# Altium project waterpump.PrjPCB
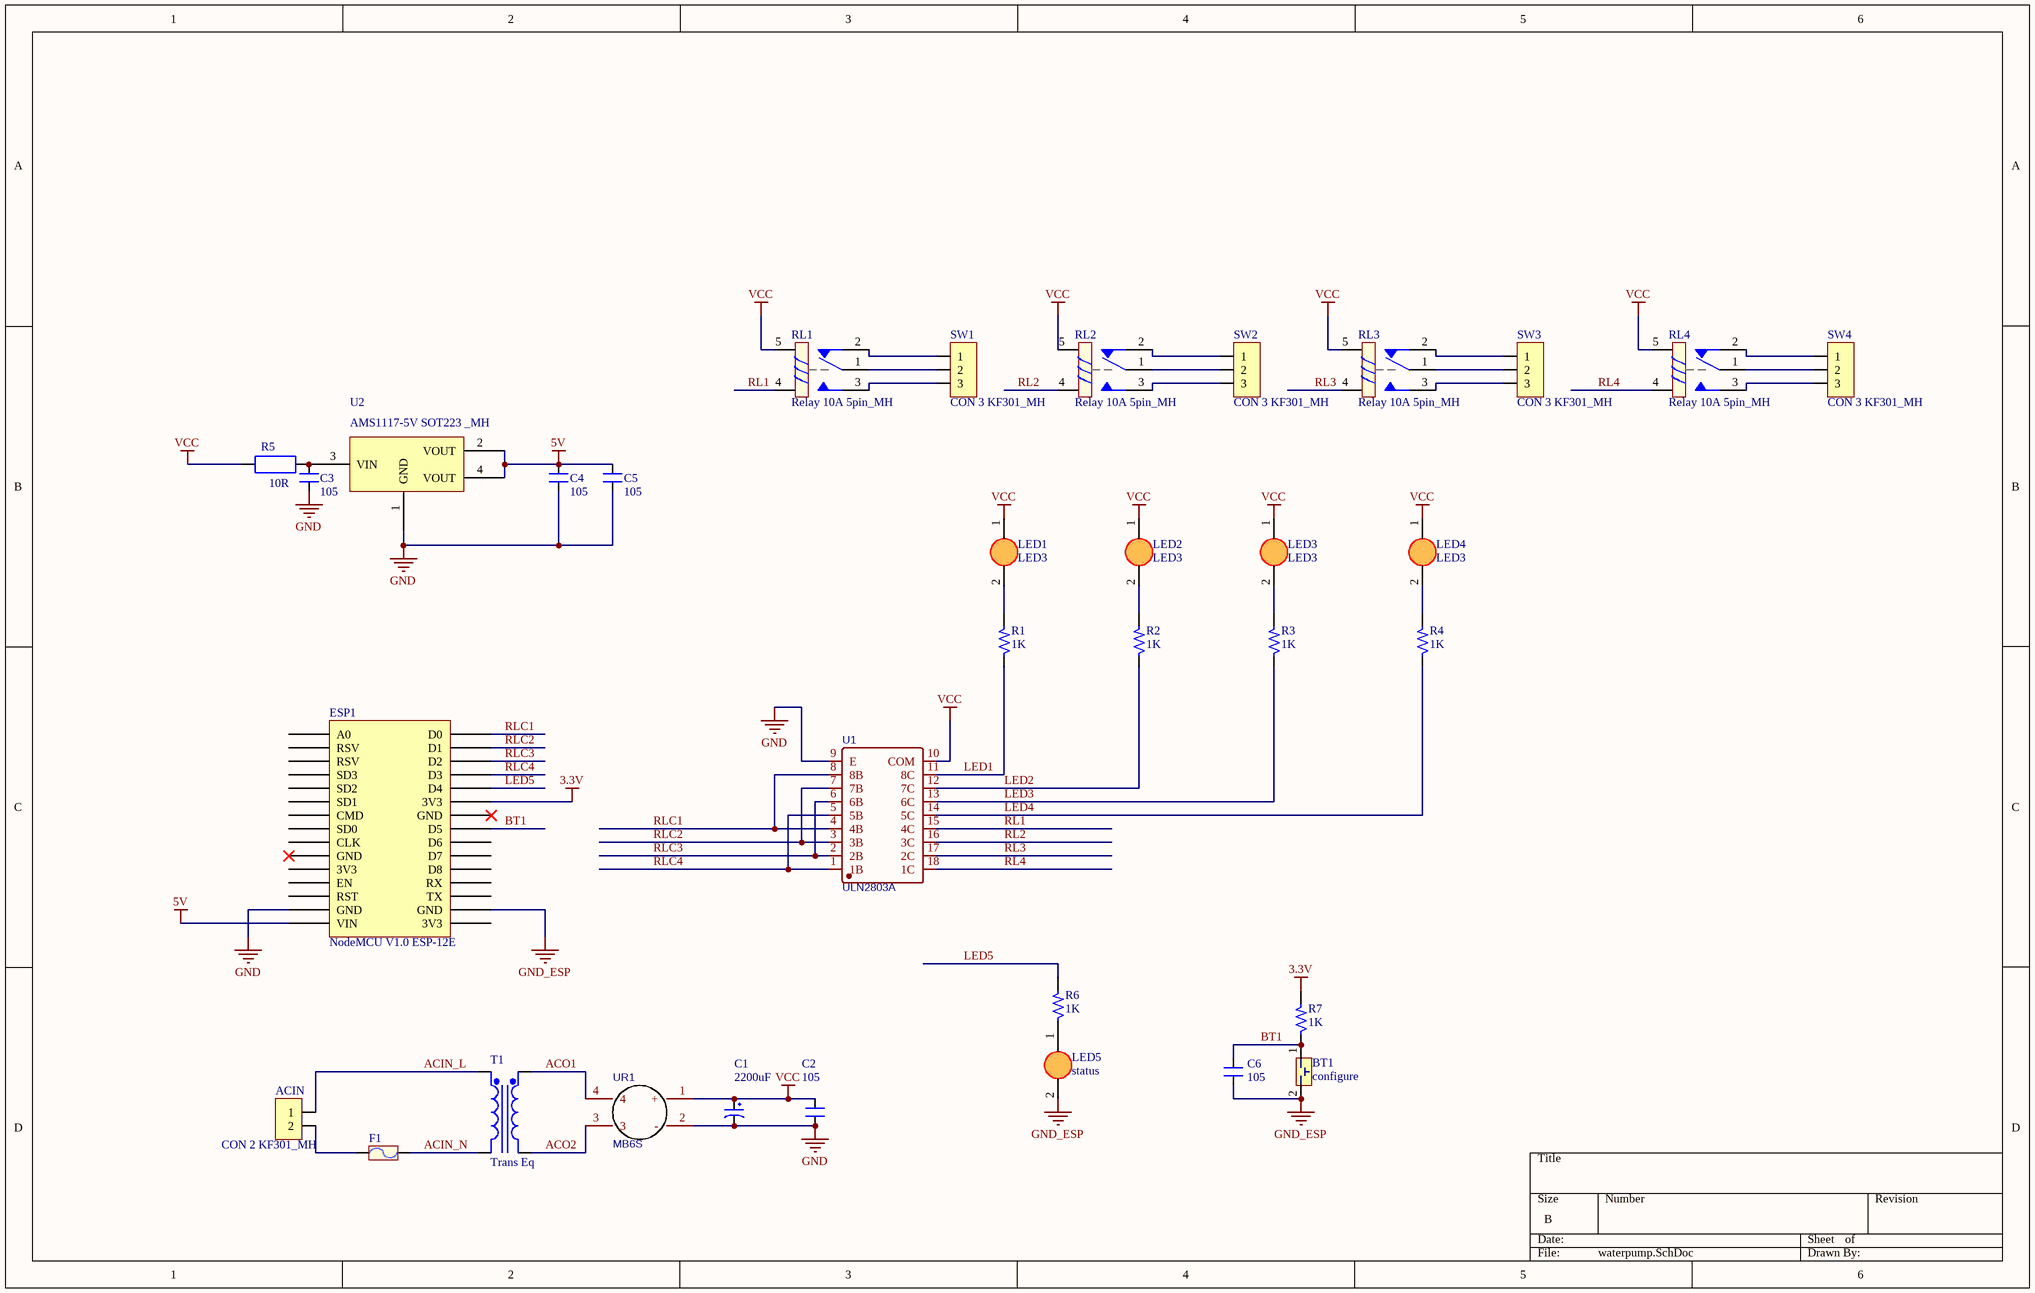
[diagram p0: waterpump.SchDoc]
1 sheet, 34 parts. Net scope: global (net labels, ports and power ports of the same name join across sheets).
Board file: waterpump.PcbDoc

## Sheet waterpump.SchDoc
size B

### Parts
ACIN  CON 2 KF301_MH  [CON 2 KF301]
BT1  configure  [BUTTON 4P SMD]
C1  2200uF  [CP3/7]
C2  105  [0805_HV]
C3  105  [0805_HV]
C4  105  [0805_HV]
C5  105  [0805_HV]
C6  105  [0805_HV]
ESP1  NodeMCU V1.0 ESP-12E  [ESP-8266]
F1  FUSE_AUTO_0.5A 8V 1206_MH  [FUSE 1206]  (value not drawn)
LED1  LED3  [LED 3mm Do]
LED2  LED3  [LED 3mm Do]
LED3  LED3  [LED 3mm Do]
LED4  LED3  [LED 3mm Do]
LED5  status  [LED_0805]
R1  1K  [0805_HV]
R2  1K  [0805_HV]
R3  1K  [0805_HV]
R4  1K  [0805_HV]
R5  10R  [TRO_VACH_2W]
R6  1K  [0805_HV]
R7  1K  [0805_HV]
RL1  Relay 10A 5pin_MH  [relay 10A 5pin]
RL2  Relay 10A 5pin_MH  [relay 10A 5pin]
RL3  Relay 10A 5pin_MH  [relay 10A 5pin]
RL4  Relay 10A 5pin_MH  [relay 10A 5pin]
SW1  CON 3 KF301_MH  [CON 3 KF301]
SW2  CON 3 KF301_MH  [CON 3 KF301]
SW3  CON 3 KF301_MH  [CON 3 KF301]
SW4  CON 3 KF301_MH  [CON 3 KF301]
T1  Trans Eq  [AS3010]
U1  ULN2803A  [SOIC-18_300MIL]
U2  AMS1117-5V SOT223 _MH  [SOT223]
UR1  MB6S  [MB6S]

### Nets
3.3V: ESP1.3V3 R7.2
5V: C4.2 C5.2 ESP1.VIN U2.2(VOUT) U2.4(VOUT)
GND: C1.2 C2.1 C3.1 C4.1 C5.1 ESP1.GND U1.9(E) U2.1(GND) UR1.2(-)
GND_ESP: BT1.2 C6.1 ESP1.GND LED5.2(K)
VCC: C1.1 C2.2 LED1.1(A) LED2.1(A) LED3.1(A) LED4.1(A) R5.1 RL1.5 RL2.5 RL3.5 RL4.5 U1.10(COM) UR1.1(+)
ACIN_L: ACIN.1 T1.1(Pri+)
ACIN_N: F1.2 T1.2(Pri-)
ACO1: T1.3(Sec+) UR1.4
ACO2: T1.4(Sec-) UR1.3
BT1: BT1.1 C6.2 ESP1.D5 R7.1
LED1: R1.1 U1.11(8C)
LED2: R2.1 U1.12(7C)
LED3: R3.1 U1.13(6C)
LED4: R4.1 U1.14(5C)
LED5: ESP1.D4 R6.2
RL1: RL1.4 U1.15(4C)
RL2: RL2.4 U1.16(3C)
RL3: RL3.4 U1.17(2C)
RL4: RL4.4 U1.18(1C)
RLC1: ESP1.D0 U1.4(4B) U1.8(8B)
RLC2: ESP1.D1 U1.3(3B) U1.7(7B)
RLC3: ESP1.D2 U1.2(2B) U1.6(6B)
RLC4: ESP1.D3 U1.1(1B) U1.5(5B)
NetACIN_2: ACIN.2 F1.1
NetC3_2: C3.2 R5.2 U2.3(VIN)
NetLED1_2: LED1.2(K) R1.2
NetLED2_2: LED2.2(K) R2.2
NetLED3_2: LED3.2(K) R3.2
NetLED4_2: LED4.2(K) R4.2
NetLED5_1: LED5.1(A) R6.1
NetRL1_1: RL1.1 SW1.2
NetRL1_2: RL1.2 SW1.1
NetRL1_3: RL1.3 SW1.3
NetRL2_1: RL2.1 SW2.2
NetRL2_2: RL2.2 SW2.1
NetRL2_3: RL2.3 SW2.3
NetRL3_1: RL3.1 SW3.2
NetRL3_2: RL3.2 SW3.1
NetRL3_3: RL3.3 SW3.3
NetRL4_1: RL4.1 SW4.2
NetRL4_2: RL4.2 SW4.1
NetRL4_3: RL4.3 SW4.3

Not connected (* = marked no-connect by the designer): ESP1 A0 CLK CMD D6 D7 D8 EN RST RSV RX SD0 SD1 SD2 SD3 TX

### Library data of the parts
ACIN = CON 2 KF301_MH: CON 2 KF301, 5.08mm
BT1 = BUTTON 4P SMD_MH: Nút nhấn 4 chân, dán
C1 = TU_HOA_2200uF_25V_MH: 2200uF_25V; Description 5: 100uF=>220uF/200V -100uF=>330uF/350V; Description 1: 10KuF=>22KuF/6,3V - 6800uF=>15KuF/10V; Description 2: 4700uF=>10KuF/16V - 3300uF => 6800uF/25V; Description 3: 2200uF=>3300uF/50V_1KuF=>2200uF/63V; Description 4: 470uF => 1KuF/100V - 220uF-470uF/160V; Value: 2200uF/16V; Description 6: 33uF=>100/350V-400V  -  22uF=>33uF/450V
C2-C6 = CM: Cap SMD; Value: 103
ESP1 = NodeMCU V1.0 ESP-12E: NodeMCU V1.0 ESP8266 (ESP-12E)
F1 = FUSE_AUTO_0.5A 8V 1206_MH: Fuse
LED1-LED4 = LED 3mm_MH: LED 3mm
LED5 = LED SMD_0805_MH: LED 3mm
R1-R4 R6 R7 = R: Resistor 1/4W; Value: R1/4W - 1K
R5 = TRO_CS_2W_MH: Value: V?
RL1-RL4 = Relay 10A 5pin_MH: Relay
SW1-SW4 = CON 3 KF301_MH: CON 3 KF301, 5.08mm
T1 = Trans Eq: Transformer (Equivalent Circuit Model); Published: 8-Jun-2000; LatestRevisionDate: 17-Jul-2002; LatestRevisionNote: Re-released for DXP Platform.; PackageReference: TRF_4; Publisher: Altium Limited; PackageDescription: Transformer; 4 Leads
U1 = ULN2803A: BOM_Manufacturer: Sinotech Mixic Elec; Contributor: LCSC; SMT Type: Extend; BOM_Supplier: LCSC; BOM_Supplier Part: C181731; BOM_Manufacturer Part: ULN2803A; BOM_LCSC Assembly: Yes; spicePre: U
U2 = AMS1117-3.3V SOT223 _MH
UR1 = MB6S: BOM_Manufacturer: STARSEA; SMT Type: Extend; BOM_Supplier: LCSC; BOM_Manufacturer Part: MB6S; BOM_Supplier Part: C83964; BOM_LCSC Assembly: Yes; spicePre: U